# Altium schematic sheet MainBoard_XMega.SchDoc
size A
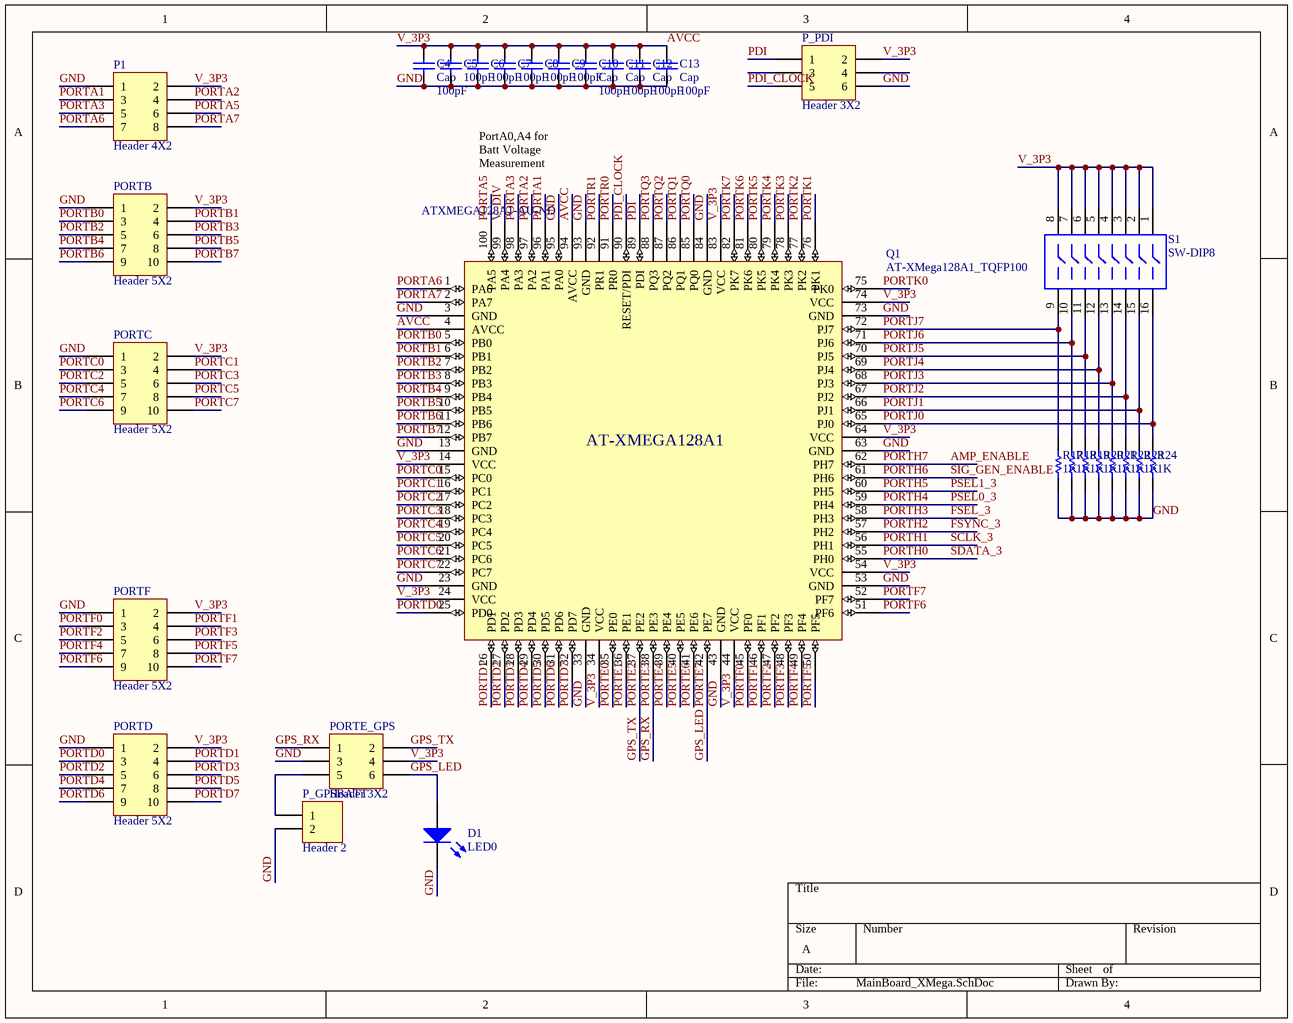
[diagram p0: MainBoard_XMega.SchDoc]

## Parts
C4  Cap  value 100pF  [CAPR2.54-5.1x3.2]
C5  value 100pF  [CAPR2.54-5.1x3.2]  (hidden comment: Cap)
C6  value 100pF  [CAPR2.54-5.1x3.2]  (hidden comment: Cap)
C7  value 100pF  [CAPR2.54-5.1x3.2]  (hidden comment: Cap)
C8  value 100pF  [CAPR2.54-5.1x3.2]  (hidden comment: Cap)
C9  value 100pF  [CAPR2.54-5.1x3.2]  (hidden comment: Cap)
C10  Cap  value 100pF  [CAPR2.54-5.1x3.2]
C11  Cap  value 100pF  [CAPR2.54-5.1x3.2]
C12  Cap  value 100pF  [CAPR2.54-5.1x3.2]
C13  Cap  value 100pF  [CAPR2.54-5.1x3.2]
D1  LED0  [LED-0]
P1  Header 4X2  [HDR2X4]
P_GPSBATT  Header 2  [HDR1X2]
P_PDI  Header 3X2  [HDR2X3]
PORTB  Header 5X2  [HDR2X5]
PORTC  Header 5X2  [HDR2X5]
PORTD  Header 5X2  [HDR2X5]
PORTE_GPS  Header 3X2  [HDR2X3]
PORTF  Header 5X2  [HDR2X5]
Q1  AT-XMega128A1_TQFP100  Supplier Part Number 1: ATXMEGA128A1-AU-ND  [TQFP100_L]
R17  value 1K  [AXIAL-0.3]  (hidden comment: Res1)
R18  value 1K  [AXIAL-0.3]  (hidden comment: Res1)
R19  value 1K  [AXIAL-0.3]  (hidden comment: Res1)
R20  value 1K  [AXIAL-0.3]  (hidden comment: Res1)
R21  value 1K  [AXIAL-0.3]  (hidden comment: Res1)
R22  value 1K  [AXIAL-0.3]  (hidden comment: Res1)
R23  value 1K  [AXIAL-0.3]  (hidden comment: Res1)
R24  value 1K  [AXIAL-0.3]  (hidden comment: Res1)
S1  SW-DIP8  [DIP-16-KEY]

## Nets
AMP_ENABLE: Q1.62(PH7)  [also labelled PORTH7]
AVCC: C4.2 C5.2 C6.2 C7.2 C8.2 C9.2 C10.2 C11.2 C12.2 C13.2 P1.2 P_PDI.2 PORTB.2 PORTC.2 PORTD.2 PORTE_GPS.4 PORTF.2 Q1.4(AVCC) Q1.14(VCC) Q1.24(VCC) Q1.34(VCC) Q1.44(VCC) Q1.54(VCC) Q1.64(VCC) Q1.74(VCC) Q1.83(VCC) Q1.94(AVCC) S1.1 S1.2 S1.3 S1.4 S1.5 S1.6 S1.7 S1.8  [also labelled V_3P3]
FSEL_3: Q1.58(PH3)  [also labelled PORTH3]
FSYNC_3: Q1.57(PH2)  [also labelled PORTH2]
GND: C4.1 C5.1 C6.1 C7.1 C8.1 C9.1 C10.1 C11.1 C12.1 C13.1 D1.2(K) P1.1 P_GPSBATT.2 P_PDI.6 PORTB.1 PORTC.1 PORTD.1 PORTE_GPS.3 PORTF.1 Q1.3(GND) Q1.13(GND) Q1.23(GND) Q1.33(GND) Q1.43(GND) Q1.53(GND) Q1.63(GND) Q1.73(GND) Q1.84(GND) Q1.93(GND) Q1.95(PA0) R17.1 R18.1 R19.1 R20.1 R21.1 R22.1 R23.1 R24.1
GPS_LED: D1.1(A) PORTE_GPS.6 Q1.42(PE7)  [also labelled PORTE7]
GPS_RX: PORTE_GPS.1 Q1.38(PE3)  [also labelled PORTE3]
GPS_TX: PORTE_GPS.2 Q1.37(PE2)  [also labelled PORTE2]
PDI: P_PDI.1 Q1.89(PDI)
PDI_CLOCK: P_PDI.5 Q1.90(RESET/PDI)
PORTA1: P1.3 Q1.96(PA1)
PORTA2: P1.4 Q1.97(PA2)
PORTA3: P1.5 Q1.98(PA3)
PORTA5: P1.6 Q1.100(PA5)
PORTA6: P1.7 Q1.1(PA6)
PORTA7: P1.8 Q1.2(PA7)
PORTB0: PORTB.3 Q1.5(PB0)
PORTB1: PORTB.4 Q1.6(PB1)
PORTB2: PORTB.5 Q1.7(PB2)
PORTB3: PORTB.6 Q1.8(PB3)
PORTB4: PORTB.7 Q1.9(PB4)
PORTB5: PORTB.8 Q1.10(PB5)
PORTB6: PORTB.9 Q1.11(PB6)
PORTB7: PORTB.10 Q1.12(PB7)
PORTC0: PORTC.3 Q1.15(PC0)
PORTC1: PORTC.4 Q1.16(PC1)
PORTC2: PORTC.5 Q1.17(PC2)
PORTC3: PORTC.6 Q1.18(PC3)
PORTC4: PORTC.7 Q1.19(PC4)
PORTC5: PORTC.8 Q1.20(PC5)
PORTC6: PORTC.9 Q1.21(PC6)
PORTC7: PORTC.10 Q1.22(PC7)
PORTD0: PORTD.3 Q1.25(PD0)
PORTD1: PORTD.4 Q1.26(PD1)
PORTD2: PORTD.5 Q1.27(PD2)
PORTD3: PORTD.6 Q1.28(PD3)
PORTD4: PORTD.7 Q1.29(PD4)
PORTD5: PORTD.8 Q1.30(PD5)
PORTD6: PORTD.9 Q1.31(PD6)
PORTD7: PORTD.10 Q1.32(PD7)
PORTE0: Q1.35(PE0)
PORTE1: Q1.36(PE1)
PORTE4: Q1.39(PE4)
PORTE5: Q1.40(PE5)
PORTE6: Q1.41(PE6)
PORTF0: PORTF.3 Q1.45(PF0)
PORTF1: PORTF.4 Q1.46(PF1)
PORTF2: PORTF.5 Q1.47(PF2)
PORTF3: PORTF.6 Q1.48(PF3)
PORTF4: PORTF.7 Q1.49(PF4)
PORTF5: PORTF.8 Q1.50(PF5)
PORTF6: PORTF.9 Q1.51(PF6)
PORTF7: PORTF.10 Q1.52(PF7)
PORTH0: Q1.55(PH0)  [also labelled SDATA_3]
PORTH1: Q1.56(PH1)  [also labelled SCLK_3]
PORTH4: Q1.59(PH4)  [also labelled PSEL0_3]
PORTH5: Q1.60(PH5)  [also labelled PSEL1_3]
PORTH6: Q1.61(PH6)  [also labelled SIG_GEN_ENABLE]
PORTJ0: Q1.65(PJ0) R24.2 S1.16
PORTJ1: Q1.66(PJ1) R23.2 S1.15
PORTJ2: Q1.67(PJ2) R22.2 S1.14
PORTJ3: Q1.68(PJ3) R21.2 S1.13
PORTJ4: Q1.69(PJ4) R20.2 S1.12
PORTJ5: Q1.70(PJ5) R19.2 S1.11
PORTJ6: Q1.71(PJ6) R18.2 S1.10
PORTJ7: Q1.72(PJ7) R17.2 S1.9
PORTK0: Q1.75(PK0)
PORTK1: Q1.76(PK1)
PORTK2: Q1.77(PK2)
PORTK3: Q1.78(PK3)
PORTK4: Q1.79(PK4)
PORTK5: Q1.80(PK5)
PORTK6: Q1.81(PK6)
PORTK7: Q1.82(PK7)
PORTQ0: Q1.85(PQ0)
PORTQ1: Q1.86(PQ1)
PORTQ2: Q1.87(PQ2)
PORTQ3: Q1.88(PQ3)
PORTR0: Q1.91(PR0)
PORTR1: Q1.92(PR1)
V_DIV: Q1.99(PA4)
NetP_GPSBATT_1: P_GPSBATT.1 PORTE_GPS.5

Not connected (* = marked no-connect by the designer): P_PDI 3 4

## Notes on the sheet
- PortA0,A4 for
  Batt Voltage Measurement
- (in symbol AT-XMega128A1_TQFP100) AT-XMEGA128A1

## Library data of the parts
C4-C13 = Cap: Capacitor; Published: 8-Jun-2000; LatestRevisionDate: 17-Jul-2002; LatestRevisionNote: Re-released for DXP Platform.; PackageReference: RAD-0.3; Publisher: Altium Limited
D1 = LED0: Typical INFRARED GaAs LED; Published: 8-Jun-2000; LatestRevisionDate: 08-Jul-2005; LatestRevisionNote: Mech Layer 1 removed.; PackageReference: LED-0; Publisher: Altium Limited
P1 = Header 4X2: Header, 4-Pin, Dual row; LatestRevisionDate: 17-Jul-2002; LatestRevisionNote: Re-released for DXP Platform.; Publisher: Altium Limited
P_GPSBATT = Header 2: Header, 2-Pin; LatestRevisionDate: 17-Jul-2002; LatestRevisionNote: Re-released for DXP Platform.; Publisher: Altium Limited
P_PDI PORTE_GPS = Header 3X2: Header, 3-Pin, Dual row; LatestRevisionDate: 17-Jul-2002; LatestRevisionNote: Re-released for DXP Platform.; Publisher: Altium Limited
PORTB PORTC PORTD PORTF = Header 5X2: Header, 5-Pin, Dual row; LatestRevisionDate: 17-Jul-2002; LatestRevisionNote: Re-released for DXP Platform.; Publisher: Altium Limited
R17-R24 = Res1: Resistor; Published: 8-Jun-2000; LatestRevisionDate: 17-Jul-2002; LatestRevisionNote: Re-released for DXP Platform.; PackageReference: AXIAL-0.3; Publisher: Altium Limited
S1 = SW-DIP8: 4009 Series DIP Switch, Raised actuator; Published: 24-Mar-1999; LatestRevisionDate: 17-Dec-2003; LatestRevisionNote: PCB Footprint replaced.; PackageReference: DIP-16-KEY; Publisher: Altium Limited; ComponentLink1Description: Manufacturer Link; ComponentLink1URL: http://www.oupiin.com/prodindx.html#Headers
Q1 = AT-XMega128A1_TQFP100: Supplier 1: Digi-Key